# EAGLE design atarimovie (EAGLE 9.6.2)
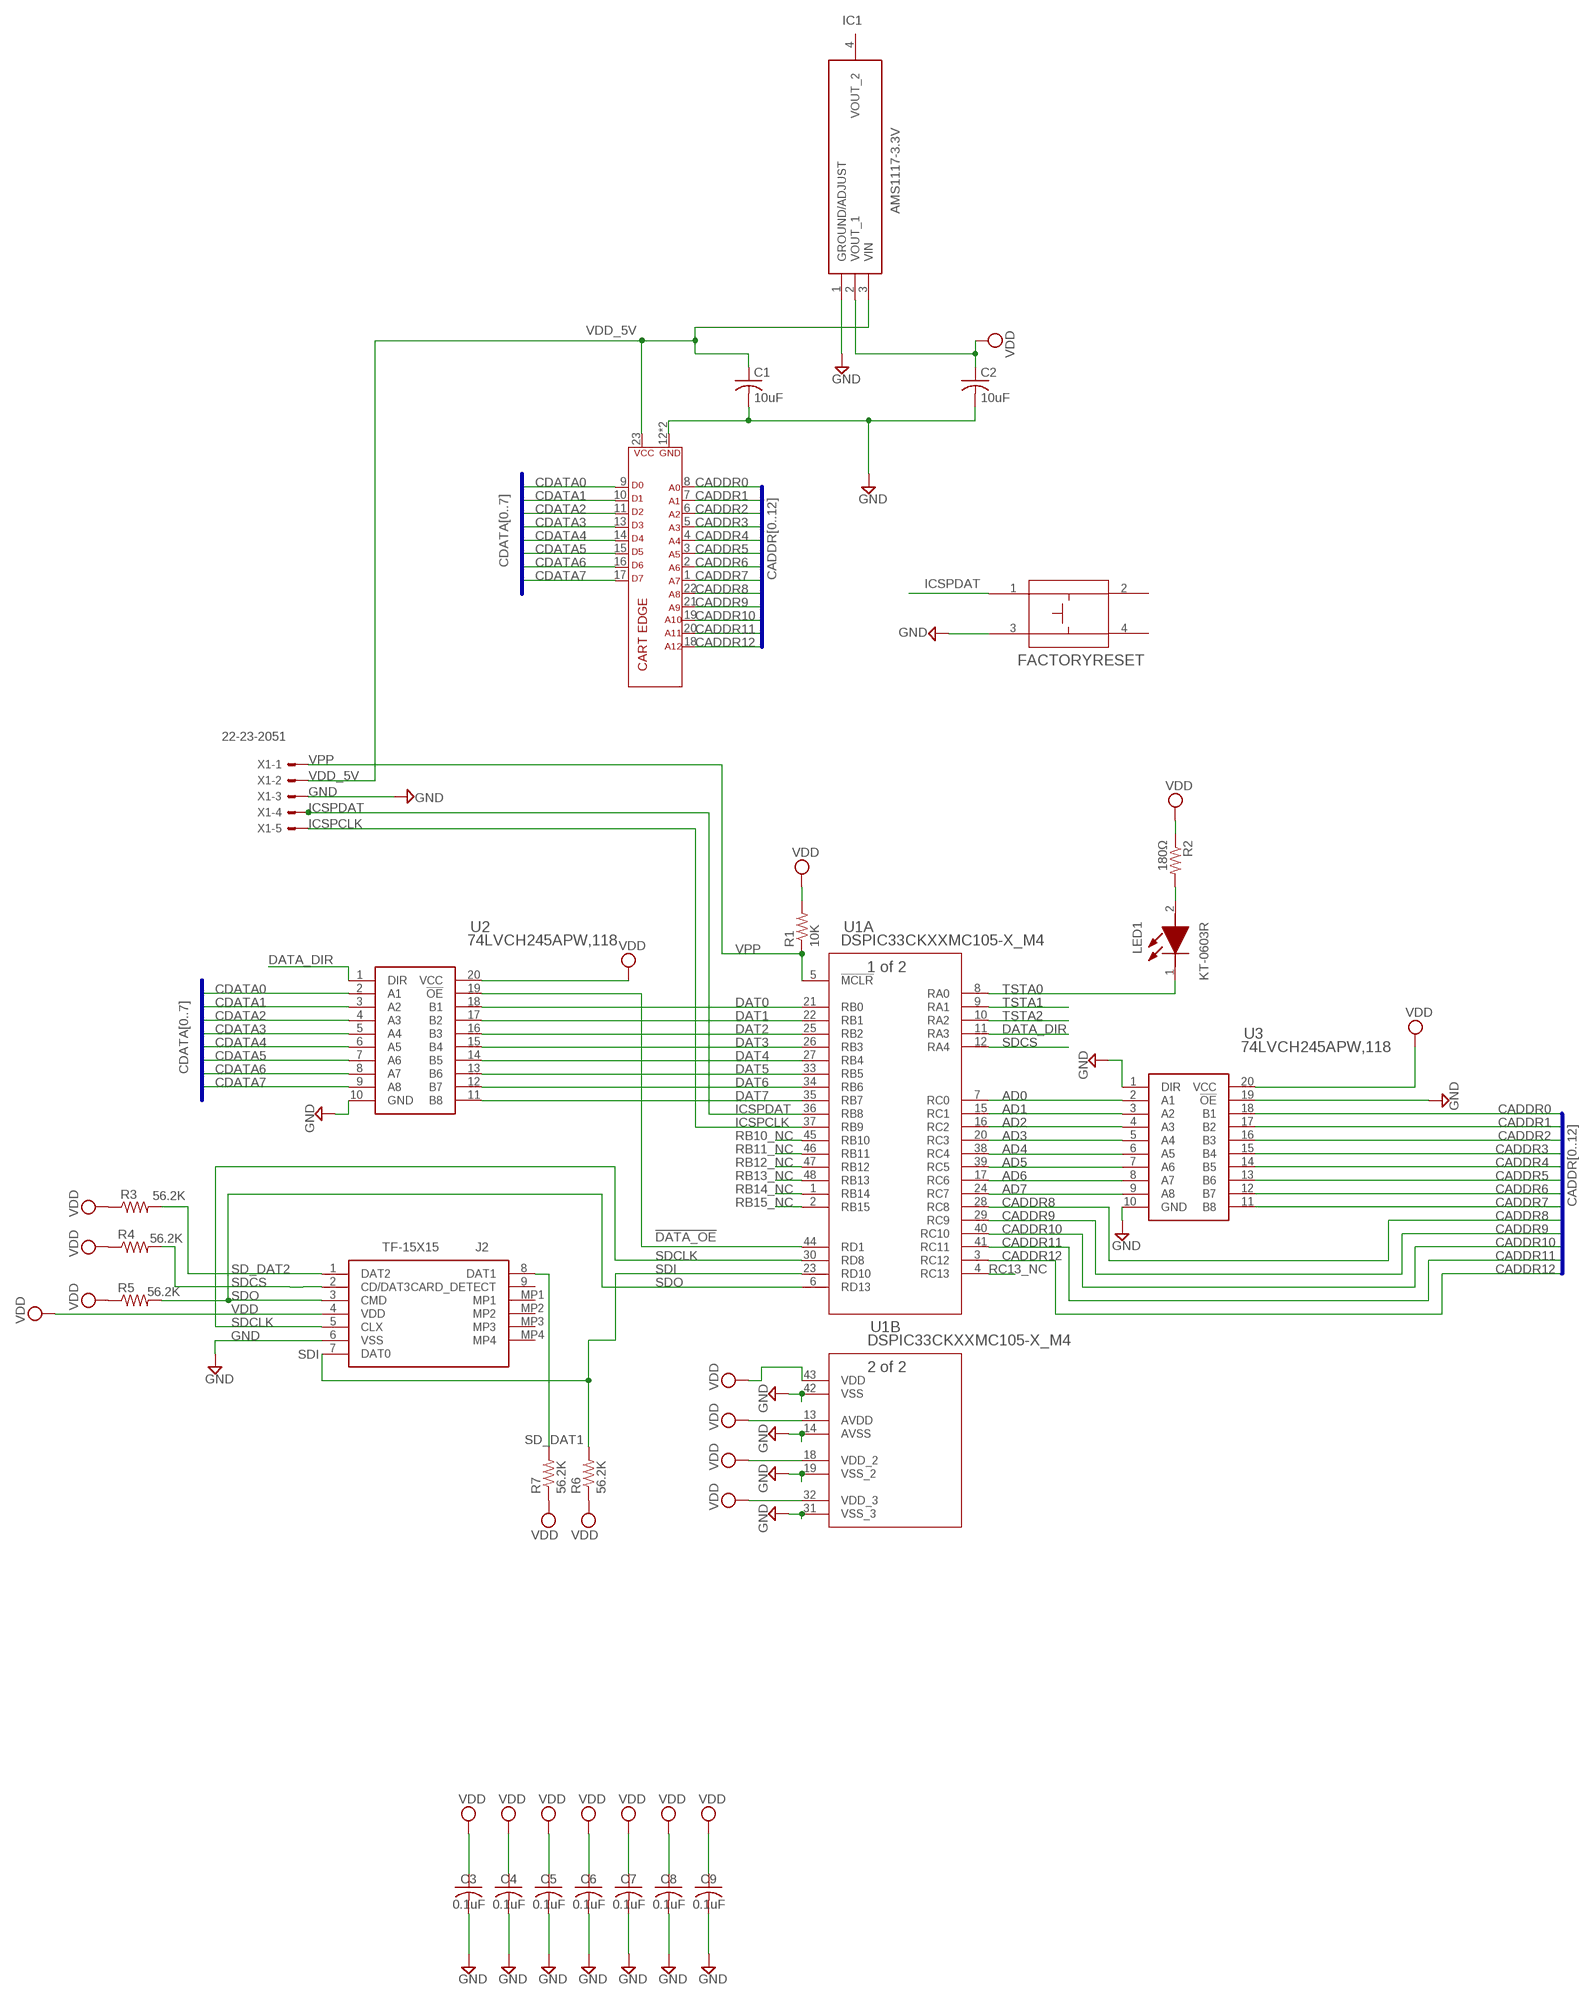
[diagram p0: schematic, sheet 1]

## Parts
C1  10uF  C-USC0603K  [C0603K]
C2  10uF  C-USC0603K  [C0603K]
C3  0.1uF  C-USC0603K  [C0603K]
C4  0.1uF  C-USC0603K  [C0603K]
C5  0.1uF  C-USC0603K  [C0603K]
C6  0.1uF  C-USC0603K  [C0603K]
C7  0.1uF  C-USC0603K  [C0603K]
C8  0.1uF  C-USC0603K  [C0603K]
C9  0.1uF  C-USC0603K  [C0603K]
FACTORYRESET  RT3301AF260Q  [RT3301_EWI]
IC1  AMS1117-3.3V  [SOT229P700X180-4N]
J1  CARTRIDGE EDGE  ATARI-2600MED_TABS_SDACCESS  [MED_TABS_SDACCESS]
J2  TF-15X15  [TF15X15]
LED1  KT-0603R  [LEDC1608X70N]
R1  10K  R-US_R0603  [R0603]
R2  180Ω  R-US_R0603  [R0603]
R3  56.2K  R-US_R0603  [R0603]
R4  56.2K  R-US_R0603  [R0603]
R5  56.2K  R-US_R0603  [R0603]
R6  56.2K  R-US_R0603  [R0603]
R7  56.2K  R-US_R0603  [R0603]
U1  DSPIC33CKXXMC105-X_M4  [UQFN48_6X6MC_MCH]
U2  74LVCH245APW,118  [SOP65P640X110-20N]
U3  74LVCH245APW,118  [SOP65P640X110-20N]
X1  22-23-2051  [22-23-2051]

## Nets
!DATA_OE!: U1.44(A:RD1) U2.19(!OE)
AD0: U1.7(A:RC0) U3.2(A1)
AD1: U1.15(A:RC1) U3.3(A2)
AD2: U1.16(A:RC2) U3.4(A3)
AD3: U1.20(A:RC3) U3.5(A4)
AD4: U1.38(A:RC4) U3.6(A5)
AD5: U1.39(A:RC5) U3.7(A6)
AD6: U1.17(A:RC6) U3.8(A7)
AD7: U1.24(A:RC7) U3.9(A8)
CADDR0: J1.8(A0) U3.18(B1)
CADDR1: J1.7(A1) U3.17(B2)
CADDR2: J1.6(A2) U3.16(B3)
CADDR3: J1.5(A3) U3.15(B4)
CADDR4: J1.4(A4) U3.14(B5)
CADDR5: J1.3(A5) U3.13(B6)
CADDR6: J1.2(A6) U3.12(B7)
CADDR7: J1.1(A7) U3.11(B8)
CADDR8: J1.22(A8) U1.28(A:RC8)
CADDR9: J1.21(A9) U1.29(A:RC9)
CADDR10: J1.19(A10) U1.40(A:RC10)
CADDR11: J1.20(A11) U1.41(A:RC11)
CADDR12: J1.18(A12) U1.3(A:RC12)
CDATA0: J1.9(D0) U2.2(A1)
CDATA1: J1.10(D1) U2.3(A2)
CDATA2: J1.11(D2) U2.4(A3)
CDATA3: J1.13(D3) U2.5(A4)
CDATA4: J1.14(D4) U2.6(A5)
CDATA5: J1.15(D5) U2.7(A6)
CDATA6: J1.16(D6) U2.8(A7)
CDATA7: J1.17(D7) U2.9(A8)
DAT0: U1.21(A:RB0) U2.18(B1)
DAT1: U1.22(A:RB1) U2.17(B2)
DAT2: U1.25(A:RB2) U2.16(B3)
DAT3: U1.26(A:RB3) U2.15(B4)
DAT4: U1.27(A:RB4) U2.14(B5)
DAT5: U1.33(A:RB5) U2.13(B6)
DAT6: U1.34(A:RB6) U2.12(B7)
DAT7: U1.35(A:RB7) U2.11(B8)
DATA_DIR: U1.11(A:RA3) U2.1(DIR)
GND: C1.2 C2.2 C3.2 C4.2 C5.2 C6.2 C7.2 C8.2 C9.2 FACTORYRESET.3 IC1.1(GROUND/ADJUST) J1.12(GND) J1.24(GND) J2.6(VSS) U1.14(B:AVSS) U1.19(B:VSS_2) U1.31(B:VSS_3) U1.42(B:VSS) U2.10(GND) U3.1(DIR) U3.10(GND) U3.19(!OE) X1.3
ICSPCLK: U1.37(A:RB9) X1.5
ICSPDAT: FACTORYRESET.1 U1.36(A:RB8) X1.4
N$1: LED1.2(A) R2.2
RB10_NC: U1.45(A:RB10)
RB11_NC: U1.46(A:RB11)
RB12_NC: U1.47(A:RB12)
RB13_NC: U1.48(A:RB13)
RB14_NC: U1.1(A:RB14)
RB15_NC: U1.2(A:RB15)
RC13_NC: U1.4(A:RC13)
SD_DAT1: J2.8(DAT1) R7.2
SD_DAT2: J2.1(DAT2) R3.2
SDCLK: J2.5(CLX) U1.30(A:RD8)
SDCS: J2.2(CD/DAT3) R4.2 U1.12(A:RA4)
SDI: J2.7(DAT0) R6.2 U1.23(A:RD10)
SDO: J2.3(CMD) R5.2 U1.6(A:RD13)
TSTA0: LED1.1(K) U1.8(A:RA0)
TSTA1: U1.9(A:RA1)
TSTA2: U1.10(A:RA2)
VDD: C2.1 C3.1 C4.1 C5.1 C6.1 C7.1 C8.1 C9.1 IC1.2(VOUT_1) J2.4(VDD) R1.2 R2.1 R3.1 R4.1 R5.1 R6.1 R7.1 U1.13(B:AVDD) U1.18(B:VDD_2) U1.32(B:VDD_3) U1.43(B:VDD) U2.20(VCC) U3.20(VCC)
VDD_5V: C1.1 IC1.3(VIN) J1.23(VCC) X1.2
VPP: R1.1 U1.5(A:!MCLR) X1.1
Unconnected: FACTORYRESET.2 FACTORYRESET.4 IC1.4(VOUT_2) J2.9(CARD_DETECT) J2.MP1 J2.MP2 J2.MP3 J2.MP4

## Buses
CADDR[0..12]
CDATA[0..7]

## Library data of the parts
C1-C9 = rcl:C-US: CAPACITOR, American symbol; SPICEPREFIX: C
FACTORYRESET = a26board:RT3301AF260Q: RT3301 reverse smt tactile switch 6x6; COPYRIGHT: Copyright (C) 2025 Ultra Librarian. All rights reserved.; MANUFACTURER_PART_NUMBER: RT3301AF260Q; MFR_NAME: E-Switch; TYPE: Tactile Switches
IC1 = ams1117-3.3v:AMS1117-3.3V: 1A LOW DROPOUT VOLTAGE REGULATOR, SOT-223 Source: Datasheet <http://www.advanced-monolithic.com/pdf/ds1117.pdf>; DESCRIPTION: 1A LOW DROPOUT VOLTAGE REGULATOR, SOT-223; HEIGHT: 1.8mm; MANUFACTURER_NAME: Advanced Monolithic Systems; MANUFACTURER_PART_NUMBER: ams1117-3.3v
J1 = a26board:ATARI-2600: Atari 2600 cartridge board
J2 = TF-15X15:TF-15X15: Micro-SD Card Socket Source: Datasheet <https://datasheet.lcsc.com/szlcsc/SOFNG-TF-15-15_C111196.pdf>; DESCRIPTION: Micro-SD Card Socket; HEIGHT: 1.85mm; MANUFACTURER_NAME: SOFNG; MANUFACTURER_PART_NUMBER: TF-15X15
LED1 = KT-0603R:KT-0603R: Red 615~630nm 1.9~2.2V 0603 Light Emitting Diodes (LED) RoHS Source: Datasheet <https://datasheet.lcsc.com/szlcsc/Hubei-KENTO-Elec-KT-0603R_C2286.pdf>; DESCRIPTION: Red 615~630nm 1.9~2.2V 0603 Light Emitting Diodes (LED) RoHS; HEIGHT: 0.7mm; MANUFACTURER_NAME: Hubei KENTO Elec; MANUFACTURER_PART_NUMBER: KT-0603R
R1-R7 = resistor:R-US_: RESISTOR, American symbol
U1 = parts_mc2:DSPIC33CKXXMC105-X_M4: IC MCU 16BIT 32KB FLASH 48UQFN; COPYRIGHT: Copyright (C) 2022 Ultra Librarian. All rights reserved.; MANUFACTURER_PART_NUMBER: dsPIC33CKXXMC105-X_M4; MFR_NAME: Microchip
U2 U3 = 74LVCH245APW_118:74LVCH245APW,118: 74LVC(H)245A - Octal bus transceiver; 3-state@en-us Source: Datasheet <https://assets.nexperia.com/documents/data-sheet/74LVC_LVCH245A.pdf>; DESCRIPTION: 74LVC(H)245A - Octal bus transceiver; 3-state@en-us; HEIGHT: 1.1mm; MANUFACTURER_NAME: Nexperia; MANUFACTURER_PART_NUMBER: 74LVCH245APW,118; MOUSER_PART_NUMBER: 771-74LVCH245APW-T; MOUSER_PRICE-STOCK: https://www.mouser.co.uk/ProductDetail/Nexperia/74LVCH245APW118?qs=me8TqzrmIYU8gTXvbc8b4g%3D%3D
X1 = con-molex:22-23-2051: .100" (2.54mm) Center Header - 5 Pin; MF: MOLEX; MPN: 22-23-2051; OC_FARNELL: 1462952; OC_NEWARK: 38C9178

## Board
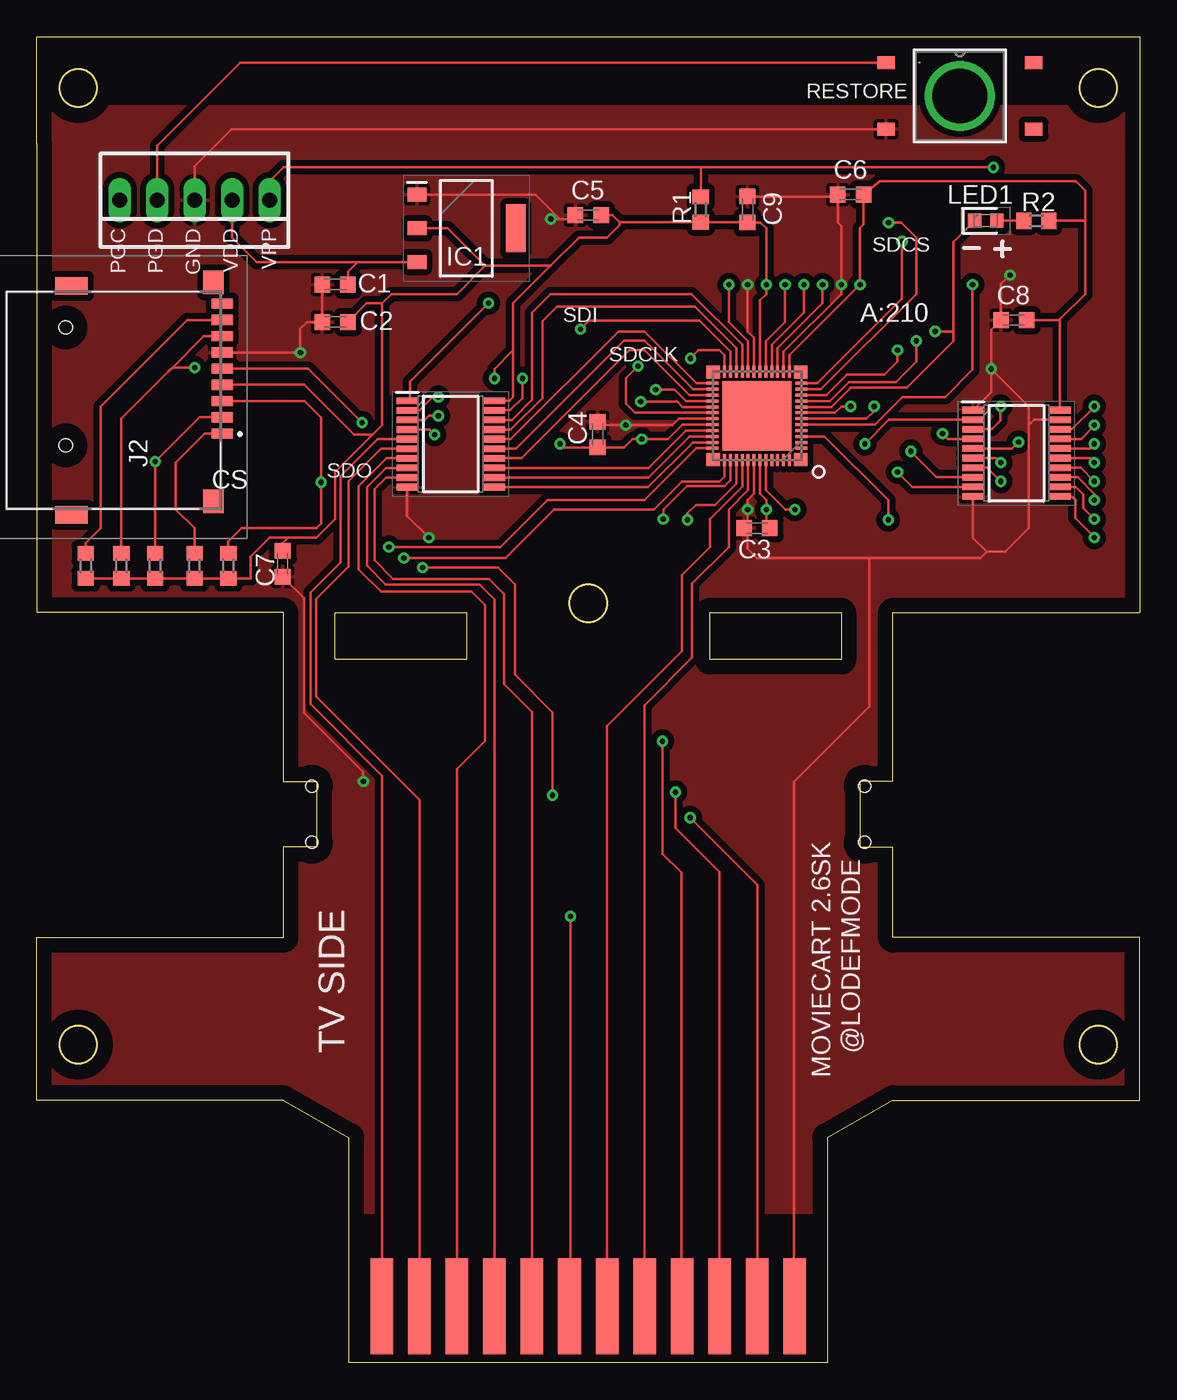
[diagram p1: board, top side]
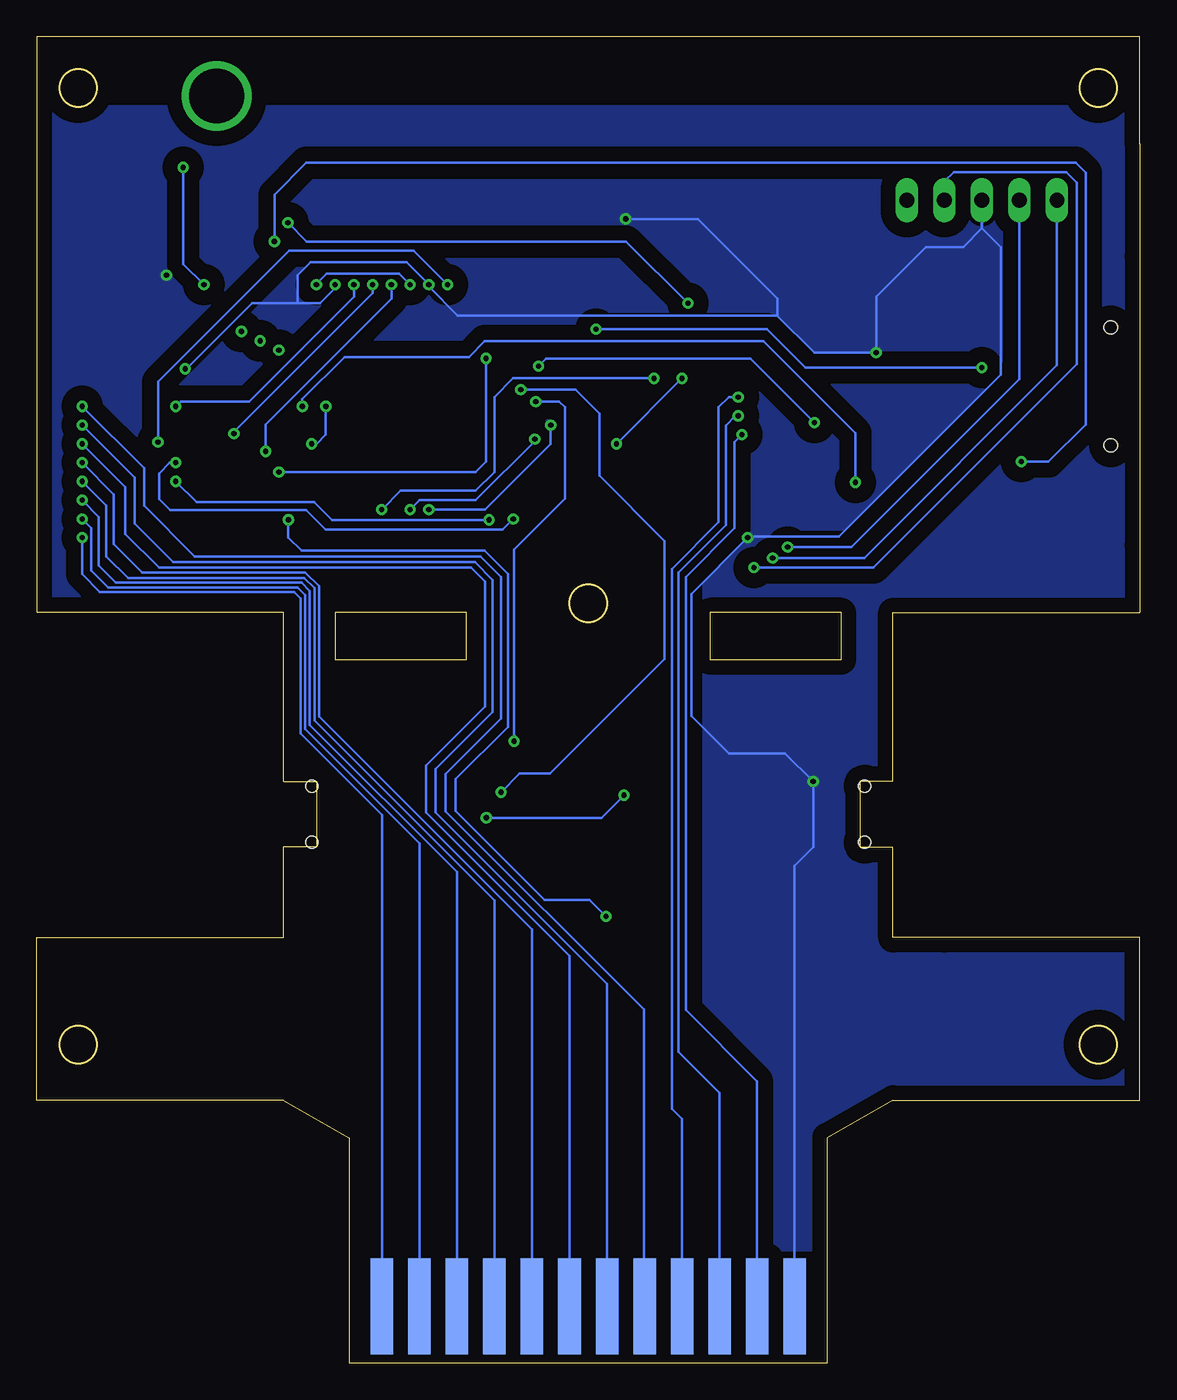
[diagram p2: board, bottom side, seen from below]

Size 74.7 x 89.8 mm. Coordinates in mm from the lower left corner, seen from the top.
Copper layers (1*16): Top 0.035mm / dielectric 1.5mm / Bottom 0.035mm
Design rules "default": minimum track width 6mil, minimum drill 0.35mm, track to track 6mil, track to pad 6mil, pad to pad 6mil, via to via 6mil, smd to smd 6mil, copper to edge 40mil, drill to drill 6mil, minimum pad ring 10mil, minimum via ring 8mil, stop-mask expansion 4mil, vias tented up to drill 0mil, thermal gap 10mil

### Footprints (pad centres in the part's own frame; a part is rotated, then mirrored left to right if it is on the bottom)
C0603K = smd 1.05 x 1.08: 1 -0.875,0; 2 0.875,0
RT3301_EWI = smd 1.194 x 0.889: 1 -5,2.25; 2 5,2.25; 3 -5,-2.25; 4 5,-2.25 | drill 3.708 pad 3.708: 5 0,0
SOT229P700X180-4N = smd 1.3 x 0.95: 1 -3.35,2.29; 2 -3.35,0; 3 -3.35,-2.29 | smd 1.3 x 3.25: 4 3.35,0
MED_TABS_SDACCESS = smd 1.524 x 6.477: 1 -13.97,-46.99; 2 -11.43,-46.99; 3 -8.89,-46.99; 4 -6.35,-46.99; 5 -3.81,-46.99; 6 -1.27,-46.99; 7 1.27,-46.99; 8 3.81,-46.99; 9 6.35,-46.99; 10 8.89,-46.99; 11 11.43,-46.99; 12 13.97,-46.99 | smd 1.524 x 6.477 bottom: 13 13.97,-46.99; 14 11.43,-46.99; 15 8.89,-46.99; 16 6.35,-46.99; 17 3.81,-46.99; 18 1.27,-46.99; 19 -1.27,-46.99; 20 -3.81,-46.99; 21 -6.35,-46.99; 22 -8.89,-46.99; 23 -11.43,-46.99; 24 -13.97,-46.99 | hole 0.8: -18.733,-11.748; -18.733,-15.557; 18.733,-11.748; 18.733,-15.557
TF15X15 = smd 0.7 x 1.4: 1 2.475,6.95; 2 1.375,6.95; 3 0.275,6.95; 4 -0.825,6.95; 5 -1.925,6.95; 6 -3.025,6.95; 7 -4.125,6.95; 8 -5.225,6.95; 9 -6.325,6.95 | smd 1.6 x 1.4: MP1 -7.775,6.35; MP2 7.075,6.35 | smd 1.2 x 2.2: MP3 -7.525,-3.25; MP4 7.975,-3.25 | hole 0.9: -4.725,-3.65; 3.275,-3.65
LEDC1608X70N = smd 0.9 x 0.95: 1 -0.75,0; 2 0.75,0
R0603 = smd 1 x 1.1: 1 -0.85,0; 2 0.85,0
UQFN48_6X6MC_MCH = smd 0.813 x 0.203: 1 -3,2.2; 2 -3,1.8; 3 -3,1.4; 4 -3,1; 5 -3,0.6; 6 -3,0.2; 7 -3,-0.2; 8 -3,-0.6; 9 -3,-1; 10 -3,-1.4; 11 -3,-1.8; 12 -3,-2.2; 25 3,-2.2; 26 3,-1.8; 27 3,-1.4; 28 3,-1; 29 3,-0.6; 30 3,-0.2; 31 3,0.2; 32 3,0.6; 33 3,1; 34 3,1.4; 35 3,1.8; 36 3,2.2 | smd 0.203 x 0.813: 13 -2.2,-3; 14 -1.8,-3; 15 -1.4,-3; 16 -1,-3; 17 -0.6,-3; 18 -0.2,-3; 19 0.2,-3; 20 0.6,-3; 21 1,-3; 22 1.4,-3; 23 1.8,-3; 24 2.2,-3; 37 2.2,3; 38 1.8,3; 39 1.4,3; 40 1,3; 41 0.6,3; 42 0.2,3; 43 -0.2,3; 44 -0.6,3; 45 -1,3; 46 -1.4,3; 47 -1.8,3; 48 -2.2,3 | smd 4.699 x 4.699: 49 0,0 | smd 0.889 x 0.889: 50 -2.962,2.962; 51 -2.962,-2.962; 52 2.962,-2.962; 53 2.962,2.962
SOP65P640X110-20N = smd 1.475 x 0.45: 1 -2.938,2.925; 2 -2.938,2.275; 3 -2.938,1.625; 4 -2.938,0.975; 5 -2.938,0.325; 6 -2.938,-0.325; 7 -2.938,-0.975; 8 -2.938,-1.625; 9 -2.938,-2.275; 10 -2.938,-2.925; 11 2.938,-2.925; 12 2.938,-2.275; 13 2.938,-1.625; 14 2.938,-0.975; 15 2.938,-0.325; 16 2.938,0.325; 17 2.938,0.975; 18 2.938,1.625; 19 2.938,2.275; 20 2.938,2.925
22-23-2051 = drill 1 long: 1 -5.08,0; 2 -2.54,0; 3 0,0; 4 2.54,0; 5 5.08,0

### Placement (x,y rotation side)
C1  20.21,73.03 180 top
C2  20.21,70.48 180 top
C3  48.78,56.52 180 top
C4  37.99,62.87 90 top
C5  37.35,77.72 180 top
C6  55.13,79.12 180 top
C7  16.65,54.1 270 top
C8  66.18,70.61 180 top
C9  48.15,78.11 90 top
FACTORYRESET  62.52,85.8 0 top
IC1  29.1,76.83 0 top
J1  37.35,50.8 0 bottom
J2  5.6,65.41 270 top
LED1  64.27,77.34 0 top
R1  44.97,78.11 270 top
R2  67.7,77.34 180 top
R3  10.68,53.98 90 top
R4  8.01,53.98 90 top
R5  12.97,53.98 90 top
R6  5.73,53.98 90 top
R7  3.31,53.98 90 top
U1  48.78,64.14 180 top
U2  28.03,62.23 0 top
U3  66.36,61.59 0 top
X1  10.68,78.74 180 top

### Tracks (layer width: path | path; a pad name or v marks a point on that pad's centre or on a via)
!DATA_OE!  (via drill 0.35)
  Top 0.152: U1.44 49.38,59.09 50.7,57.77 v51.36,57.77 | U2.19 32.07,64.5 32.91,65.34 v32.91,66.67
  Bottom 0.152: v32.91,66.67 42.43,66.67 43.7,65.41 43.7,60.33 44.97,59.05 50.05,59.05 51.33,57.77 v51.36,57.77
AD0  (via drill 0.35)
  Top 0.152: U1.7 54.06,64.33 54.5,64.77 v55.13,64.77 | v56.08,62.23 57.72,63.87 U3.2
  Bottom 0.152: v55.13,64.77 55.13,62.87 55.77,62.23 v56.08,62.23
AD1  (via drill 0.35)
  Top 0.152: U1.15 50.18,68.71 53.23,71.75 v53.23,73.03 | v65.29,64.77 65.27,64.75 65.27,63.8 64.69,63.22 U3.3
  Bottom 0.152: v53.23,73.03 53.23,72.2 60.34,65.09 64.97,65.09 v65.29,64.77
AD2  (via drill 0.35)
  Top 0.152: U1.16 49.78,68.94 51.96,71.12 v51.96,73.03 | U3.4 61.71,62.57 v61.35,62.93
  Bottom 0.152: v51.96,73.03 51.96,72.44 61.41,62.99 v61.35,62.93
AD3  (via drill 0.35)
  Top 0.152: U1.20 48.18,69.18 46.88,70.48 v46.88,73.03 | v66.5,62.36 66.06,61.92 U3.5
  Bottom 0.152: v66.5,62.36 66.5,66.46 57.62,75.34 49.19,75.34 v46.88,73.03
AD4  (via drill 0.35)
  Top 0.152: U1.38 46.98,59.8 46.57,59.38 44.03,59.38 42.43,57.78 v42.43,57.15 | v65.29,60.96 64.98,61.27 U3.6
  Bottom 0.152: v65.29,60.96 65.71,60.96 66.43,60.24 66.43,58.51 65.68,57.76 56.48,57.76 55.13,56.41 43.17,56.41 v42.43,57.15
AD5  (via drill 0.35)
  Top 0.152: U1.39 47.38,59.56 45.92,58.1 44.65,58.1 44.08,57.53 v44.08,57.09 | U3.7 64.36,60.62 v65.29,59.69
  Bottom 0.152: v44.08,57.09 54.71,57.09 55.91,58.28 63.88,58.28 v65.29,59.69
AD6  (via drill 0.35)
  Top 0.152: U1.17 49.38,69.18 50.69,70.48 v50.69,73.03 | v59.19,61.72 60.95,59.97 U3.8
  Bottom 0.152: v59.19,61.72 59.19,63.55 50.69,72.06 v50.69,73.03
AD7  (via drill 0.35)
  Top 0.152: U1.24 46.58,68.24 46.24,68.58 44.83,68.58 v44.27,68.02 | U3.9 59.31,59.32 v58.3,60.33
  Bottom 0.152: v44.27,68.02 44.27,61.02 44.97,60.33 v58.3,60.33
CADDR0  (via drill 0.35)
  Top 0.152: U3.18 70.12,63.22 71.64,64.74 v71.64,64.77
  Bottom 0.152: v71.64,64.77 67.45,60.58 67.45,58.04 64.02,54.61 44.65,54.61 43.26,53.21 43.26,43.62 47,39.88 47,37.34 33.59,23.93 33.59,3.81 J1.8
CADDR1  (via drill 0.35)
  Top 0.152: U3.17 70.74,62.57 71.64,63.47 v71.64,63.5
  Bottom 0.152: v71.64,63.5 68.08,59.94 68.08,56.83 65.48,54.23 45.03,54.23 43.83,53.02 43.83,44.07 47.7,40.2 47.7,37.27 36.08,25.65 36.08,6.4 36.03,6.4 36.03,3.81 J1.7
CADDR2  (via drill 0.35)
  Top 0.152: U3.16 71.33,61.92 v71.64,62.23
  Bottom 0.152: v71.64,62.23 68.72,59.31 68.72,56.13 66.43,53.85 45.27,53.85 44.34,52.91 44.34,44.45 48.34,40.45 48.34,37.27 38.62,27.56 J1.6
CADDR3  (via drill 0.35)
  Top 0.152: U3.15 71.33,61.27 v71.64,60.96
  Bottom 0.152: v71.64,60.96 69.48,58.8 69.48,55.44 67.58,53.53 56.53,53.53 55.59,52.59 55.59,43.76 41.16,29.34 J1.5
CADDR4  (via drill 0.35)
  Top 0.152: U3.14 70.71,60.62 v71.64,59.69
  Bottom 0.152: J1.4 43.7,31.32 55.89,43.51 55.89,52.45 56.59,53.15 68.53,53.15 69.99,54.61 69.99,58.04 v71.64,59.69
CADDR5  (via drill 0.35)
  Top 0.152: U3.13 70.5,59.97 71.64,58.83 v71.64,58.42
  Bottom 0.152: v71.64,58.42 70.5,57.28 70.5,53.98 69.35,52.83 56.78,52.83 56.21,52.26 56.21,43.19 46.24,33.22 J1.3
CADDR6  (via drill 0.35)
  Top 0.152: v71.64,57.15 70.9,57.89 70.9,58.8 70.38,59.32 U3.12
  Bottom 0.152: v71.64,57.15 71,56.52 71,53.66 69.86,52.51 57.04,52.51 56.53,52.01 56.53,42.93 48.78,35.18 J1.2
CADDR7  (via drill 0.35)
  Top 0.152: U3.11 70.12,58.67 70.34,58.45 70.34,57.21 71.64,55.91 v71.64,55.88
  Bottom 0.152: v71.64,55.88 71.64,53.4 70.43,52.2 57.29,52.2 56.85,51.75 56.85,42.63 51.32,37.1 J1.1
CADDR8  (via drill 0.35)
  Top 0.152: U1.28 43.97,65.14 43.19,65.91 v41.92,65.91 | v43.27,38.63 43.27,36.22 46.24,33.25 J1.22
  Bottom 0.152: v41.92,65.91 38.23,65.91 36.59,64.28 36.59,60.07 32.17,55.65 32.17,47.67 39.94,39.9 42,39.9 v43.27,38.63
CADDR9  (via drill 0.35)
  Top 0.152: U1.29 43.74,64.73 43.38,65.09 v40.91,65.09 | J1.21 43.65,3.81 43.65,33.2 42.38,34.47 v42.38,42.09
  Bottom 0.152: v40.91,65.09 39.32,65.09 38.94,64.71 38.93,64.71 38.93,58.52 42.38,55.07 v42.38,42.09
CADDR10
  Top 0.152: U1.40 47.78,59.33 45.61,57.15 45.61,55.24 43.7,53.34 43.7,48.2 38.62,43.12 J1.19
CADDR11
  Top 0.152: U1.41 48.18,59.09 46.88,57.78 46.88,55.24 44.39,52.76 44.39,47.75 41.16,44.53 J1.20
CADDR12  (via drill 0.35)
  Top 0.152: U1.3 53.36,62.73 57.67,58.42 v57.67,57.09 | v36.16,30.23 36.16,3.81 J1.18
  Bottom 0.152: v57.67,57.09 57.67,55.88 56.78,54.99 44.39,54.99 42.8,53.4 42.8,43.07 46.34,39.52 46.34,37.36 40.31,31.33 37.26,31.33 v36.16,30.23
CDATA0  (via drill 0.35)
  Top 0.152: U2.2 25.91,64.5 26.81,65.41 v27.19,65.41
  Bottom 0.152: J1.9 31,16.51 31.69,17.2 31.69,53.77 28.52,56.94 28.52,64.71 27.83,65.41 v27.19,65.41
CDATA1  (via drill 0.35)
  Top 0.152: U2.3 26.27,63.85 26.56,64.14 v27.19,64.14
  Bottom 0.152: v27.19,64.14 27.38,64.14 28.03,63.49 28.03,56.72 31.23,53.52 31.23,21.06 28.46,18.29 J1.10
CDATA2  (via drill 0.35)
  Top 0.152: U2.4 26.6,63.2 v26.94,62.87
  Bottom 0.152: v26.94,62.87 27.44,62.36 27.44,56.52 30.75,53.21 30.75,23.88 25.92,19.05 J1.11
CDATA3
  Top 0.152: J1.13 23.38,39.75 18.53,44.6 18.53,52.17 20.56,54.2 20.56,60.05 23.07,62.55 U2.5
CDATA4
  Top 0.152: J1.14 25.92,38.1 18.91,45.11 18.91,51.73 21.12,53.94 21.12,59.72 23.31,61.9 U2.6
CDATA5
  Top 0.152: J1.15 28.46,40.21 30.37,42.11 30.37,51.31 29.45,52.22 23.3,52.22 21.81,53.72 21.81,59.38 23.67,61.25 U2.7
CDATA6
  Top 0.152: J1.16 31,51.69 29.98,52.7 23.63,52.7 22.36,53.98 22.36,59.31 23.66,60.6 U2.8
CDATA7
  Top 0.152: J1.17 33.54,44.07 31.64,45.97 31.64,52.07 30.62,53.09 24.14,53.09 22.87,54.36 22.87,59.18 23.64,59.95 U2.9
DAT0
  Top 0.152: U1.21 47.78,68.94 44.34,72.39 34.81,72.39 33.54,71.12 33.54,65.22 32.18,63.85 U2.18
DAT1
  Top 0.152: U1.22 47.38,68.71 44.56,71.53 35.24,71.53 34.25,70.54 34.25,67.36 34.24,67.35 34.24,65.34 32.1,63.2 U2.17
DAT2
  Top 0.152: U1.25 44.68,66.33 41.16,69.85 39.38,69.85 32.09,62.55 U2.16
DAT3
  Top 0.152: U1.26 44.44,65.94 41.16,69.22 39.76,69.22 32.45,61.9 U2.15
DAT4
  Top 0.152: U1.27 44.21,65.53 41.16,68.58 40.14,68.58 32.82,61.25 U2.14
DAT5
  Top 0.152: U1.33 43.97,63.13 41.44,60.6 U2.13
DAT6
  Top 0.152: U1.34 44.21,62.73 41.42,59.95 U2.12
DAT7
  Top 0.152: U1.35 44.44,62.34 41.41,59.3 U2.11
DATA_DIR  (via drill 0.35)
  Top 0.152: U1.11 53.12,65.94 59.58,72.39 59.58,76.2 58.56,77.22 v57.7,77.22 | v30.59,71.75 25.29,66.45 25.29,65.35 U2.1
  Bottom 0.152: v57.7,77.22 56.43,75.95 34.79,75.95 v30.59,71.75
GND  (via drill 0.35)
  Top 0.152: U1.19 48.58,69.42 48.15,69.85 v48.15,73.03 | U1.14 50.58,68.47 54.5,72.39 v54.5,73.03 54.5,76.98 54.26,77.22 C6.2 54.11,78.98 C9.2 | U1.31 43.5,63.94 43.07,63.5 v39.89,63.5 38.62,63.5 38.38,63.74 C4.2 | U1.42 48.58,58.85 48.15,58.42 v48.15,57.78 48.15,56.52 | v64.66,67.31 64.66,69.96 C8.2 65.3,73.08 65.31,73.05 v65.93,73.66 | J1.24 51.27,3.81 51.27,39.32 56.4,44.45 56.4,54.36 56.25,54.51 | C3.2 48.15,56.52 | 56.25,54.51 48.78,54.51 48.15,55.14 48.15,56.52 | U2.10 25.09,57.34 v26.56,55.88 | 67.19,63.5 67.56,63.87 U3.19 | U3.1 64.66,65.75 v64.66,67.31 | v64.66,67.31 67.19,64.77 67.19,63.5 | U3.10 63.42,55.85 64.34,54.93 | 64.34,54.93 65.61,54.93 67.19,56.52 67.19,63.5 | C5.2 36.22,77.47 35.45,77.47 | 35.45,77.47 v34.81,77.47 | 64.34,54.93 63.92,54.51 56.25,54.51 | IC1.1 33.79,79.12 35.45,77.47 | C7.2 18.1,51.78 18.1,44.02 22.11,40.01 v22.11,39.37 | C1.2 C2.2 18.3,70.48 17.84,70.03 v17.84,68.41 12.58,68.41 J2.6 | X1.3 10.68,81.04 13.19,83.55 FACTORYRESET.3
  Bottom 0.152: J1.12 23.38,33.66 22.11,34.92 v22.11,39.37 24.02,41.27 27.83,41.27 30.37,43.81 30.37,52.07 v26.56,55.88 26.48,55.96 20.38,55.96 9.41,66.93 9.41,75.56 10.68,76.83 | v54.5,73.03 54.5,72.8 55.51,71.78 57.04,71.78 | 57.04,71.78 60.11,71.78 64.53,67.36 v64.66,67.31 | v48.15,57.78 44.34,57.78 39.89,62.23 v39.89,63.5 | 24.56,70.93 46.19,70.93 48.15,72.89 v48.15,73.03 49.67,74.55 56.15,74.55 57.04,73.66 57.04,71.78 | 24.56,70.93 24.52,70.93 24.52,72.07 29.92,77.47 v34.81,77.47 | X1.3 10.68,76.83 | 10.68,76.83 11.95,75.56 14.49,75.56 17.84,72.21 v17.84,68.41 22.04,68.41 24.56,70.93
  pour Bottom (isolate 1.016): -4.56,7.62 75.45,7.62 75.45,85.09 -4.56,85.09
  pour Top (isolate 0.406): -2.02,10.16 75.45,10.16 75.45,85.09 -2.02,85.09
ICSPCLK  (via drill 0.35)
  Top 0.152: U1.37 46.58,60.03 46.24,59.69 43.7,59.69 41.8,57.78 35.04,57.78 31.76,54.51 v24.85,54.51
  Bottom 0.152: v24.85,54.51 18.66,54.51 5.6,67.56 X1.5
ICSPDAT  (via drill 0.35)
  Top 0.152: U1.36 44.68,61.94 41.16,58.42 34.58,58.42 31.41,55.24 v23.84,55.24 | FACTORYRESET.1 13.77,88.05 8.14,82.42 X1.4
  Bottom 0.152: v23.84,55.24 19.52,55.24 8.14,66.62 X1.4
N$1
  Top 0.152: LED1.2 R2.2
SD_DAT1
  Top 0.152: J2.8 10.19,70.63 4.65,65.09 4.33,64.77 4.33,56.52 3.31,55.5 R7.2
SD_DAT2
  Top 0.152: R3.2 10.68,56.52 9.41,57.78 9.41,60.96 11.38,62.93 J2.1
SDCLK  (via drill 0.35)
  Top 0.152: v22.03,63.68 18.38,67.33 J2.5 | U1.30 40.53,64.33 39.89,64.97 39.89,66.67 v40.72,67.5
  Bottom 0.152: v22.03,63.68 26.37,68.01 40.21,68.01 v40.72,67.5
SDCS  (via drill 0.35)
  Top 0.152: U1.12 52.89,66.33 58.61,72.06 v58.61,75.95 | J2.2 11.02,64.03 v8.01,61.02 R4.2
  Bottom 0.152: v8.01,61.02 6.17,61.02 3.64,63.55 3.64,80.59 4.33,81.28 56.45,81.28 58.61,79.12 v58.61,75.95
SDI  (via drill 0.35)
  Top 0.152: U1.23 46.98,68.47 44.87,70.59 37.41,70.59 v36.83,70 | J2.7 11.31,69.53 9.18,67.4 | R6.2 5.73,63.94 8.93,67.15 9.18,67.4 | v10.68,67.4 9.18,67.4
  Bottom 0.152: v36.83,70 25.26,70 22.66,67.4 v10.68,67.4
SDO  (via drill 0.35)
  Top 0.152: v56.72,64.77 56.72,64.45 56.2,63.94 U1.6 | R5.2 12.97,55.63 13.86,56.52 18.94,56.52 19.25,56.83 v19.25,59.63 19.25,64.01 18.13,65.13 J2.3
  Bottom 0.152: v56.72,64.77 56.72,65.27 53.86,68.12 45.43,68.12 44.36,69.19 25.48,69.19 19.25,62.97 v19.25,59.63
TSTA0  (via drill 0.35)
  Top 0.152: U1.8 53.83,64.73 55.13,66.04 58.94,66.04 62.09,69.19 62.09,69.85 | 62.09,69.85 62.09,75.91 LED1.1 | v60.85,69.85 62.09,69.85
TSTA1  (via drill 0.35)
  Top 0.152: U1.9 53.72,65.14 55,66.42 58.18,66.42 59.58,67.82 v59.58,69.22
TSTA2  (via drill 0.35)
  Top 0.152: U1.10 53.48,65.53 54.88,66.93 57.42,66.93 58.3,67.82 v58.3,68.58
VDD  (via drill 0.35)
  Top 0.152: U1.13 50.98,68.24 v55.77,73.03 55.77,76.83 56.01,77.08 C6.1 57.09,80.01 70.37,80.01 71,79.38 71,77.22 | U1.32 43.74,63.53 42.75,62.55 v40.97,62.55 40.34,62.55 39.78,61.99 C4.1 35.69,61.99 v35.45,62.23 | U1.43 48.98,58.85 49.42,58.42 v49.42,57.78 49.42,56.52 49.66,56.27 C3.1 | R2.1 70.88,77.34 71,77.22 | 69.3,70.68 71,72.39 71,77.22 | C8.1 69.23,70.61 69.3,70.68 | U2.20 32.02,65.15 32.27,65.41 32.27,68.58 | U3.20 69.3,70.68 | C5.1 39,77.72 39.47,77.25 | 39.47,77.25 R1.2 48.12,77.25 C9.1 49.02,77.23 49.42,76.83 v49.42,73.03 49.42,72.39 48.98,71.95 U1.18 | 39.47,77.25 39.47,77.05 38.62,76.2 36.72,76.2 34.81,74.3 | 32.27,68.58 32.27,71.75 34.81,74.3 | IC1.2 27.83,76.83 30.37,74.3 | 22.75,62.87 23.38,63.5 23.38,71.75 | J2.4 18.11,66.23 21.48,62.87 22.75,62.87 | R7.1 R6.1 R4.1 R3.1 R5.1 14.49,53.12 14.49,54.61 15.76,55.88 17.03,55.88 | 17.03,55.88 18.94,55.88 20.21,57.15 20.21,60.33 22.75,62.87 | C7.1 16.65,55.5 17.03,55.88 | 23.38,71.75 24.02,72.39 28.46,72.39 30.37,74.3 | 34.81,74.3 30.37,74.3 | v31,66.67 31,67.31 32.27,68.58 | C2.1 22.35,71.75 23.38,71.75
  Bottom 0.152: v49.42,73.03 50.15,73.76 55.08,73.76 55.69,73.15 v55.77,73.03 | v49.42,57.78 48.78,58.42 44.97,58.42 40.97,62.42 v40.97,62.55 | v31,66.67 v35.45,62.23
VDD_5V  (via drill 0.35)
  Top 0.152: J1.23 48.8,3.83 48.8,32.36 v44.26,36.91 | v26.12,53.85 31.24,53.85 32.38,52.7 32.38,46.59 34.94,44.04 v34.94,38.43 | X1.2 13.22,76.2 14.88,74.55 21.73,74.55 | C1.1 21.08,73.9 21.73,74.55 | 21.73,74.55 IC1.3
  Bottom 0.152: X1.2 13.22,80.01 12.59,80.64 4.97,80.64 4.24,79.92 4.24,67.64 18.03,53.85 v26.12,53.85 | v34.94,38.43 36.46,36.91 v44.26,36.91
VPP  (via drill 0.35)
  Top 0.152: U1.5 56.77,63.53 58.64,65.41 61.54,65.41 63.39,67.25 v63.39,73.03 | 44.97,80.96 16.71,80.96 15.76,80.01 X1.1 | 44.97,80.96 v64.78,80.96 | R1.1 44.97,80.96
  Bottom 0.152: v63.39,73.03 64.78,74.42 v64.78,80.96

### Text on the board
tPlace: RESTORE | PGC | PGD | GND | VDD | VPP | A:210 | CS | TV SIDE | @LODEFMODE | MOVIECART 2.6SK
tNames: SDCS | SDI | SDCLK | SDO